# EAGLE schematic Spring2020 (EAGLE 9.6.2)
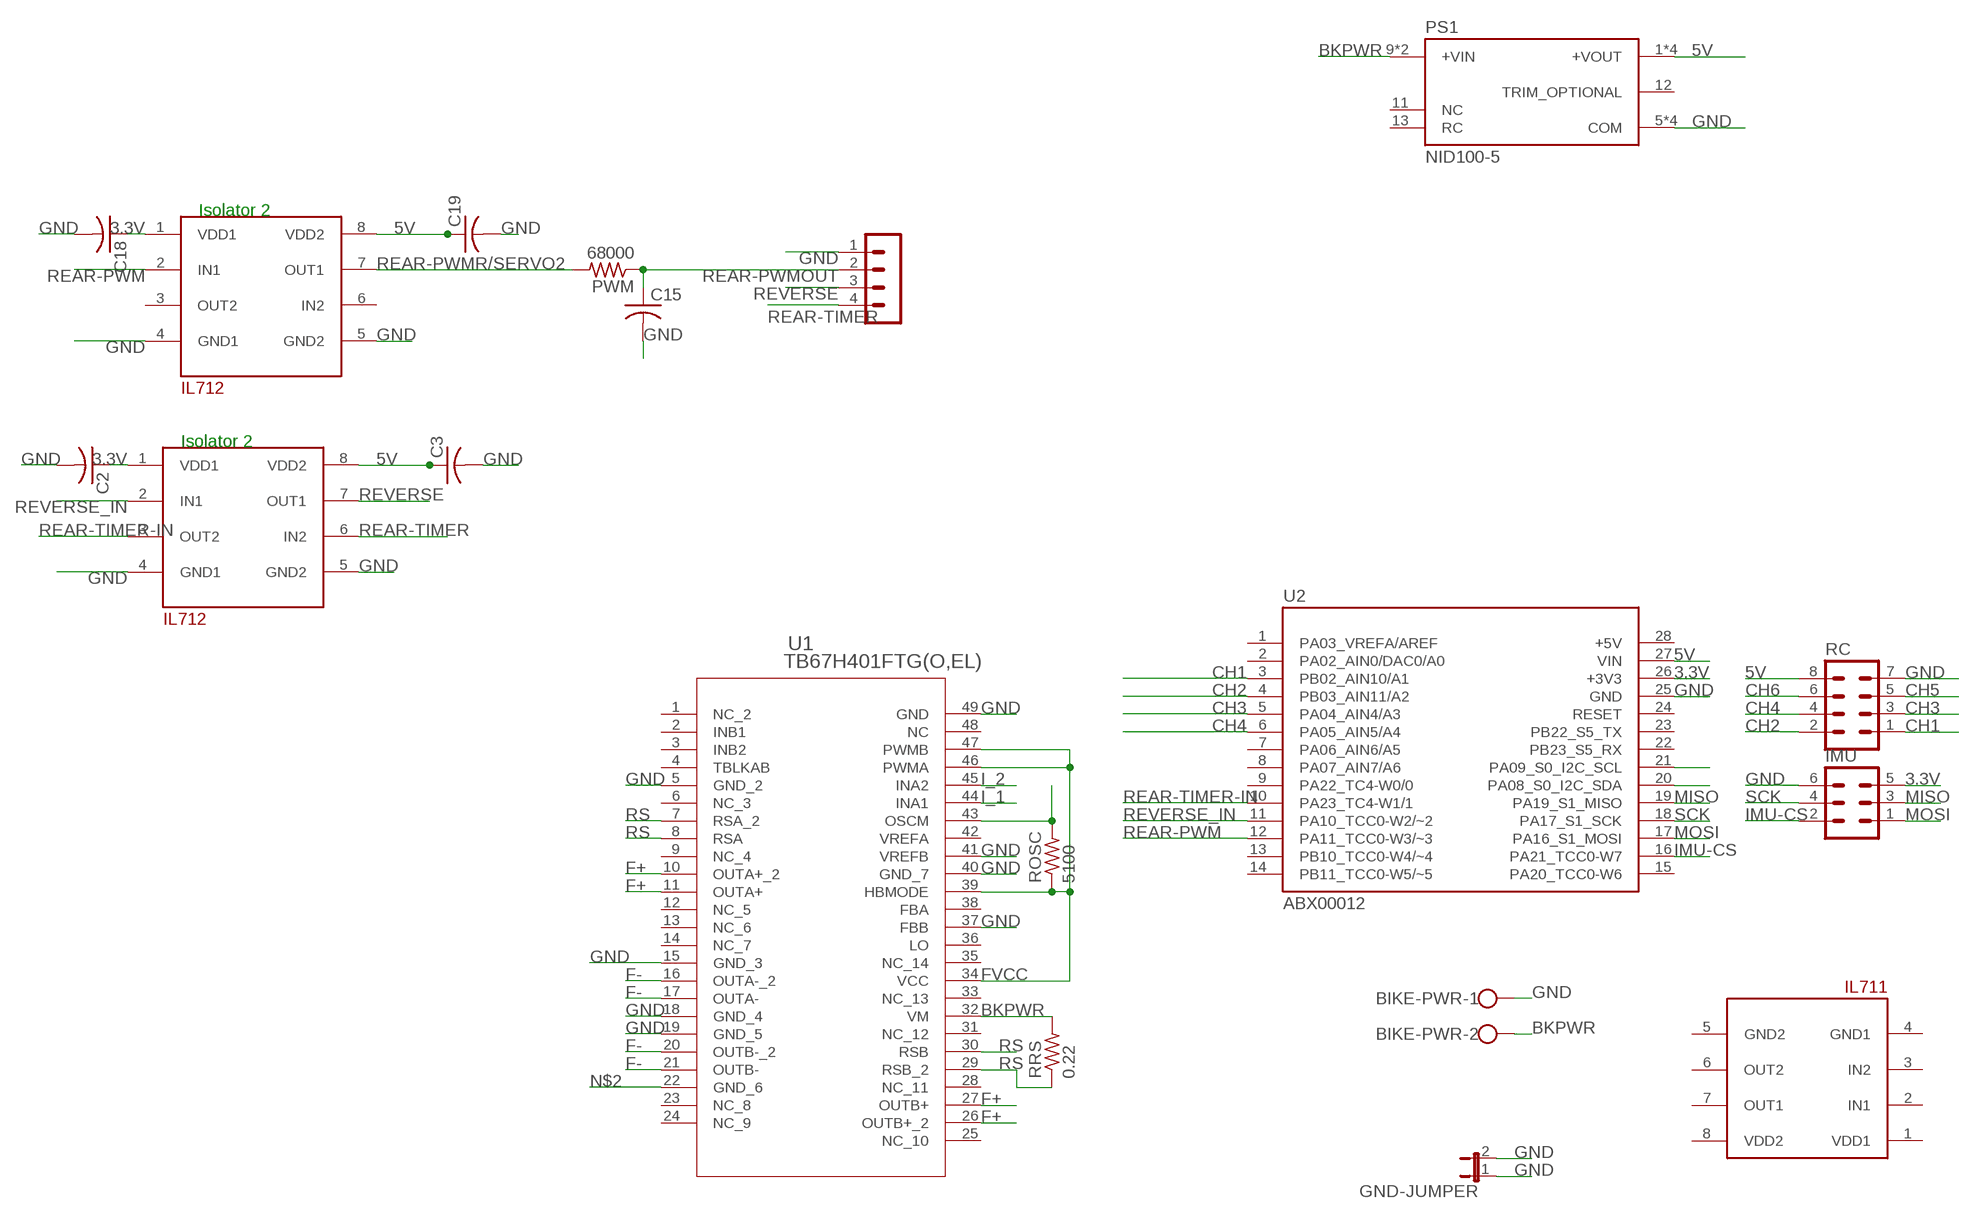
[diagram p0: schematic, sheet 1]

## Parts
BIKE-PWR  W237-102  [W237-102]
C2  C-US025-050X050  [C025-050X050]
C3  C-US025-050X050  [C025-050X050]
C15  C-US025-050X050  [C025-050X050]
C18  C-US025-050X050  [C025-050X050]
C19  C-US025-050X050  [C025-050X050]
GND-JUMPER  JP1E  [JP1]
IMU  MA03-2  [MA03-2]
PS1  NID100-5  [CONV_NID100-5]
PWM  68000  R-US_0204/2V  [0204V]
RC  MA04-2  [MA04-2]
REAR-MOTOR  MA04-1  [MA04-1]
ROSC  5100  R-US_0204/2V  [0204V]
RRS  0.22  R-US_0204/2V  [0204V]
U1  TB67H401FTG(O,EL)  [P-VQFN48-0707-0P50-004_TOS]
U2  ABX00012  [ARDUINO_ABX00012]
U$2  IL-712  [8PINSOIC]
U$3  IL-711  [8PINSOIC]
U$7  IL-712  [8PINSOIC]

## Nets
3.3V: C2.1 C18.1 IMU.5 U2.26(+3V3) U$2.1(VDD1) U$7.1(VDD1)
5V: C3.1 C19.1 PS1.1(+VOUT) PS1.2(+VOUT) PS1.3(+VOUT) PS1.4(+VOUT) RC.8 U2.27(VIN) U$2.8(VDD2) U$7.8(VDD2)
BKPWR: BIKE-PWR.2 PS1.9(+VIN) PS1.10(+VIN) RRS.2 U1.32(VM)
CH1: RC.1 U2.3(PB02_AIN10/A1)
CH2: RC.2 U2.4(PB03_AIN11/A2)
CH3: RC.3 U2.5(PA04_AIN4/A3)
CH4: RC.4 U2.6(PA05_AIN5/A4)
CH5: RC.5
CH6: RC.6
F+: U1.10(OUTA+_2) U1.11(OUTA+) U1.26(OUTB+_2) U1.27(OUTB+)
F-: U1.16(OUTA-_2) U1.17(OUTA-) U1.20(OUTB-_2) U1.21(OUTB-)
FVCC: ROSC.1 U1.34(VCC) U1.39(HBMODE) U1.46(PWMA) U1.47(PWMB)
GND: BIKE-PWR.1 C2.2 C3.2 C15.2 C18.2 C19.2 GND-JUMPER.1 GND-JUMPER.2 IMU.6 PS1.5(COM) PS1.6(COM) PS1.7(COM) PS1.8(COM) RC.7 REAR-MOTOR.1 U1.5(GND_2) U1.15(GND_3) U1.18(GND_4) U1.19(GND_5) U1.37(FBB) U1.40(GND_7) U1.41(VREFB) U1.49(GND) U2.25(GND) U$2.4(GND1) U$2.5(GND2) U$7.4(GND1) U$7.5(GND2)
I_1: U1.44(INA1)
I_2: U1.45(INA2)
IMU-CS: IMU.2 U2.16(PA21_TCC0-W7)
MISO: IMU.3 U2.19(PA19_S1_MISO)
MOSI: IMU.1 U2.17(PA16_S1_MOSI)
N$2: U1.22(GND_6)
N$5: ROSC.2 U1.43(OSCM)
N$6: U2.20(PA08_S0_I2C_SDA)
N$7: U2.21(PA09_S0_I2C_SCL)
REAR-PWM: U2.12(PA11_TCC0-W3/~3) U$7.2(IN1)
REAR-PWMOUT: C15.1 PWM.1 REAR-MOTOR.2
REAR-PWMR/SERVO2: PWM.2 U$7.7(OUT1)
REAR-TIMER: REAR-MOTOR.4 U$2.6(IN2)
REAR-TIMER-IN: U2.10(PA23_TC4-W1/1) U$2.3(OUT2)
REVERSE: REAR-MOTOR.3 U$2.7(OUT1)
REVERSE_IN: U2.11(PA10_TCC0-W2/~2) U$2.2(IN1)
RS: RRS.1 U1.7(RSA_2) U1.8(RSA) U1.29(RSB_2) U1.30(RSB)
SCK: IMU.4 U2.18(PA17_S1_SCK)
Unconnected: PS1.11(NC) PS1.12(TRIM_OPTIONAL) PS1.13(RC) U1.1(NC_2) U1.2(INB1) U1.3(INB2) U1.4(TBLKAB) U1.6(NC_3) U1.9(NC_4) U1.12(NC_5) U1.13(NC_6) U1.14(NC_7) U1.23(NC_8) U1.24(NC_9) U1.25(NC_10) U1.28(NC_11) U1.31(NC_12) U1.33(NC_13) U1.35(NC_14) U1.36(LO) U1.38(FBA) U1.48(NC) U2.1(PA03_VREFA/AREF) U2.2(PA02_AIN0/DAC0/A0) U2.7(PA06_AIN6/A5) U2.8(PA07_AIN7/A6) U2.9(PA22_TC4-W0/0) U2.13(PB10_TCC0-W4/~4) U2.14(PB11_TCC0-W5/~5) U2.15(PA20_TCC0-W6) U2.22(PB23_S5_RX) U2.23(PB22_S5_TX) U2.24(RESET) U$3.2(IN1) U$3.3(IN2) U$3.6(OUT2) U$3.7(OUT1) U$7.3(OUT2) U$7.6(IN2)

## Notes on the sheet
- Isolator 2
- Isolator 2

## Power pins joined to a net without a drawn wire
+5V: U2.28(+5V)
GND1: U$3.4(GND1)
GND2: U$3.5(GND2)
VDD1: U$3.1(VDD1)
VDD2: U$3.8(VDD2)
VREFA: U1.42(VREFA)

## Library data of the parts
BIKE-PWR = con-wago-500:W237-102: WAGO SCREW CLAMP; MPN: 237-102; OC_FARNELL: unknown; OC_NEWARK: 70K9898
C2 C3 C15 C18 C19 = resistor:C-US: CAPACITOR, American symbol
GND-JUMPER = jumper:JP1E: JUMPER
IMU = con-lstb:MA03-2: PIN HEADER; OC_FARNELL: unknown; OC_NEWARK: unknown
PS1 = SnapEDA Library:NID100-5: Non-Isolated PoL Module DC DC Converter 1 Output 5V 11A 10.5V - 53V Input; MANUFACTURER: Meanwell; MAXIMUM_PACKAGE_HEIGHT: 27.5mm; PARTREV: 2020-10-20; STANDARD: IPC-7351B
PWM ROSC RRS = rcl:R-US_: RESISTOR, American symbol; SPICEPREFIX: R
RC = con-lstb:MA04-2: PIN HEADER; OC_FARNELL: unknown; OC_NEWARK: unknown
REAR-MOTOR = con-lstb:MA04-1: PIN HEADER; OC_FARNELL: unknown; OC_NEWARK: unknown
U1 = Test:TB67H401FTG(O,EL); COPYRIGHT: Copyright (C) 2022 Ultra Librarian. All rights reserved.; DIGI-KEY_PART_NUMBER_1: TB67H401FTG(OEL)TR-ND; DIGI-KEY_PART_NUMBER_2: TB67H401FTG(OEL)CT-ND; DIGI-KEY_PART_NUMBER_3: TB67H401FTG(OEL)DKR-ND; MANUFACTURER_PART_NUMBER: TB67H401FTG(O,EL); MFR_NAME: Toshiba Electronic Devices & Storage Co.
U2 = SnapEDA Library:ABX00012: Mkrzero Brd With Headers Mounted; MANUFACTURER: Arduino; PARTREV: 5; STANDARD: Manufacturer Recommendations
U$2 U$7 = Spring2016Optoisolator:IL-712
U$3 = Spring2016Optoisolator:IL-711